# EAGLE schematic can (EAGLE 9.6.2)
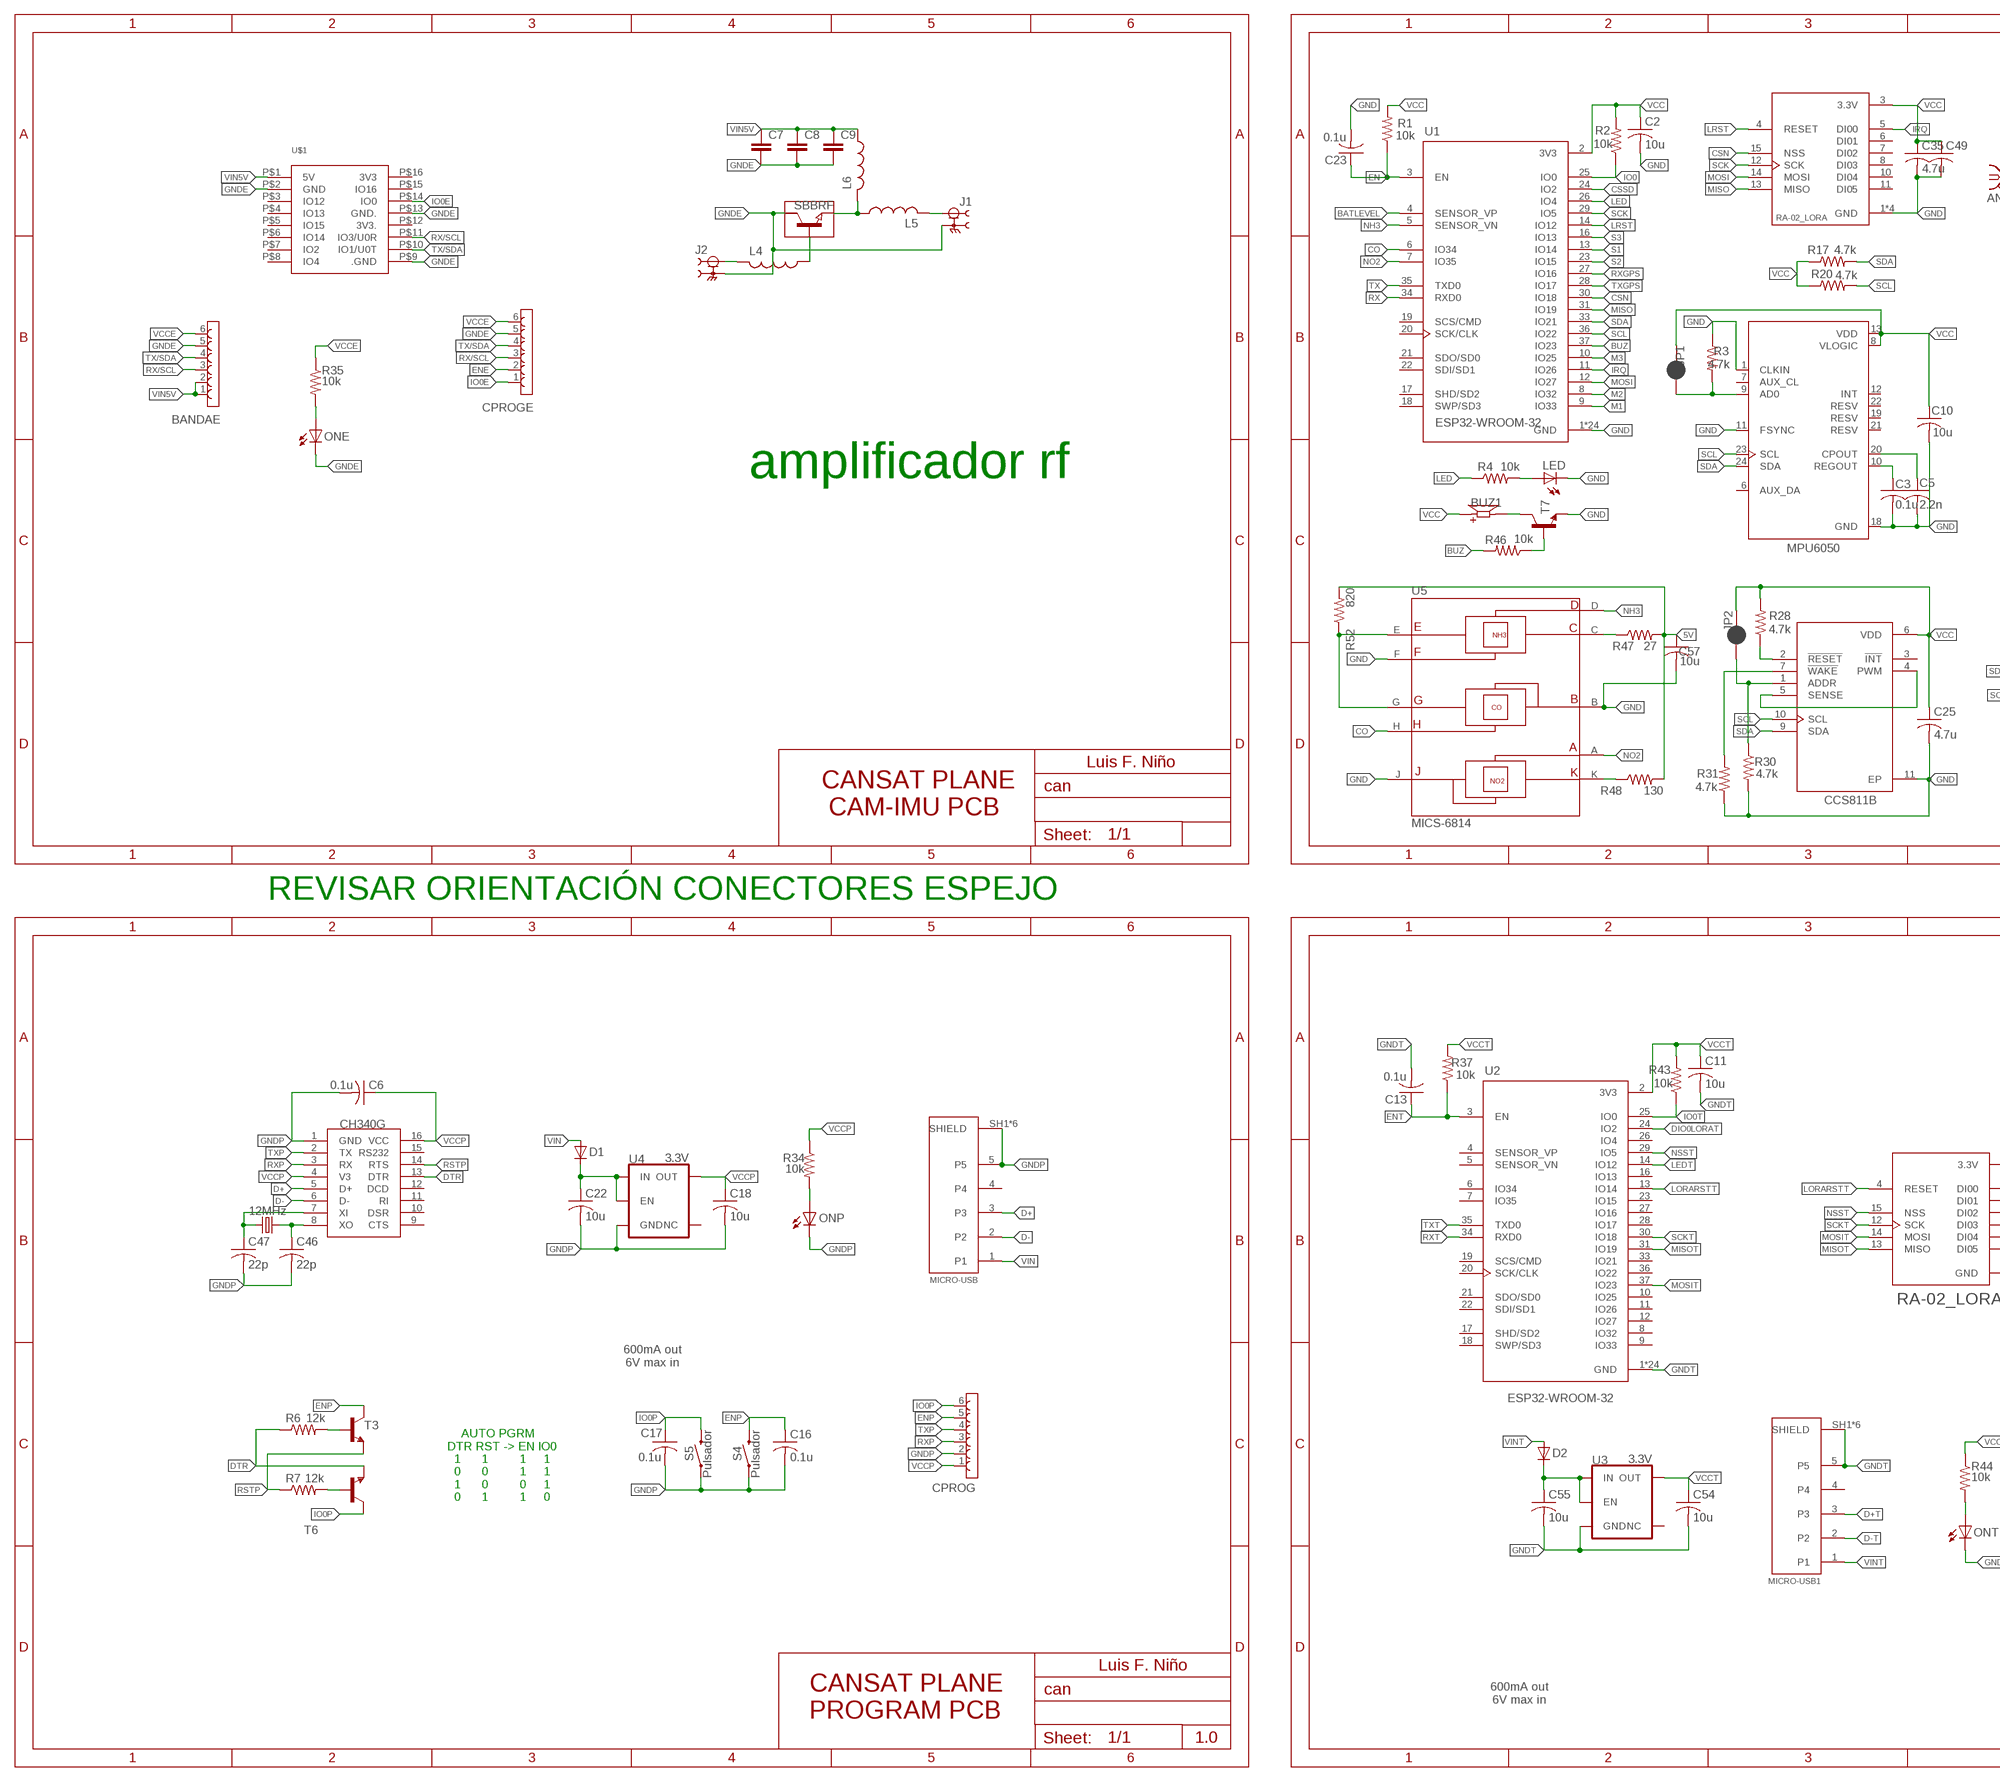
[diagram p0: schematic, sheet 1, part 1 of 2]
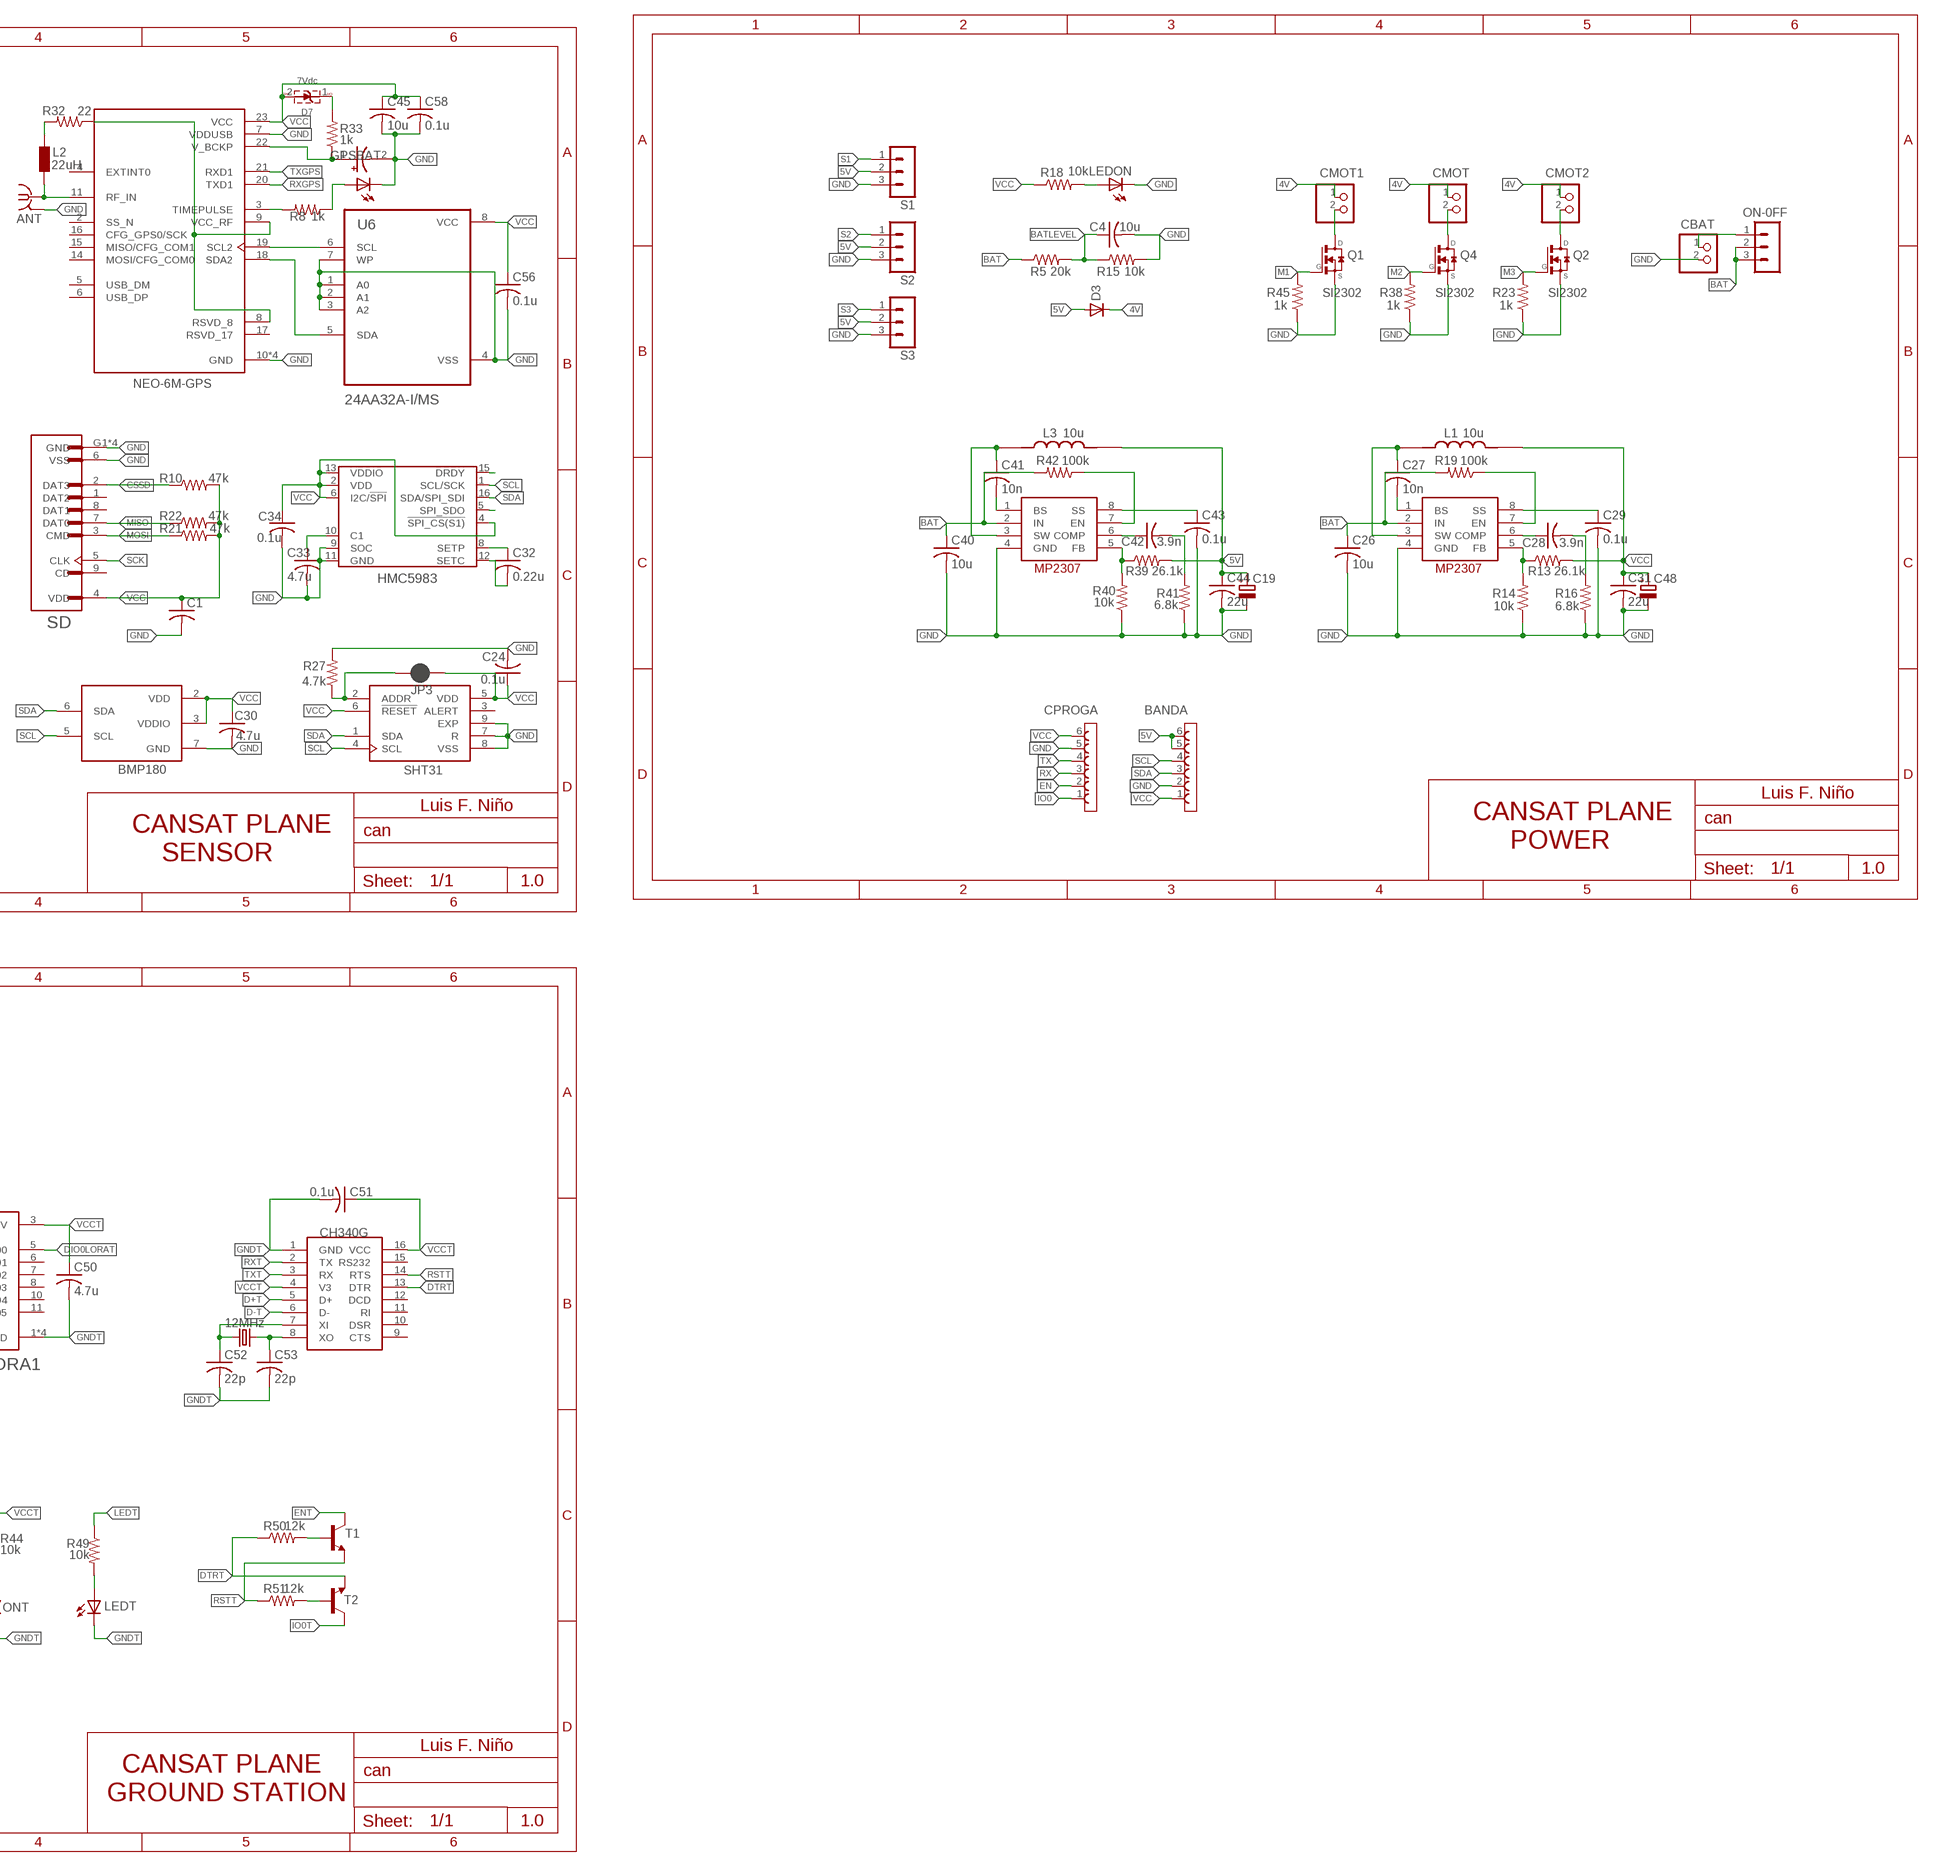
[diagram p1: schematic, sheet 1, part 2 of 2]

## Parts
BANDA  68610614122  [68610614122]
BANDAE  68610614122  [68610614122]
BMP180  BMP180  [BMP180]
BUZ1  BUZ  CMT-8530S-SMT  [CUI_CMT-8530S-SMT]
C1  C-USC0805K  [C0805K]
C2  10u  C-USC1206  [C1206]
C3  0.1u  C-USC0603K  [C0603K]
C4  10u  C-USC0603K  [C0603K]
C5  2.2n  C-USC0603K  [C0603K]
C6  0.1u  C-USC1206  [C1206]
C7  C-EUC0805K  [C0805K]
C8  C-EUC0805K  [C0805K]
C9  C-EUC0805K  [C0805K]
C10  10u  C-USC1206  [C1206]
C11  10u  C-USC1206  [C1206]
C13  0.1u  C-USC1206  [C1206]
C16  0.1u  C-USC0603K  [C0603K]
C17  0.1u  C-USC0603K  [C0603K]
C18  10u  C-USC1206  [C1206]
C19  CPOL-EU153CLV-0605  [153CLV-0605]
C22  10u  C-USC1206  [C1206]
C23  0.1u  C-USC1206  [C1206]
C24  0.1u  C-USC1206  [C1206]
C25  4.7u  C-USC1206  [C1206]
C26  10u  C-USC1206  [C1206]
C27  10n  C-USC0805  [C0805]
C28  3.9n  C-USC0805  [C0805]
C29  0.1u  C-USC0805  [C0805]
C30  4.7u  C-USC1206  [C1206]
C31  22u  C-USC1206  [C1206]
C32  0.22u  C-USC0603K  [C0603K]
C33  4.7u  C-USC0603K  [C0603K]
C34  0.1u  C-USC1206  [C1206]
C35  4.7u  C-USC1206  [C1206]
C40  10u  C-USC1206  [C1206]
C41  10n  C-USC0805  [C0805]
C42  3.9n  C-USC0805  [C0805]
C43  0.1u  C-USC0805  [C0805]
C44  22u  C-USC1206  [C1206]
C45  10u  C-USC1206  [C1206]
C46  22p  C-USC1206  [C1206]
C47  22p  C-USC1206  [C1206]
C48  CPOL-EU153CLV-0605  [153CLV-0605]
C49  C-USC0805K  [C0805K]
C50  4.7u  C-USC1206  [C1206]
C51  0.1u  C-USC1206  [C1206]
C52  22p  C-USC1206  [C1206]
C53  22p  C-USC1206  [C1206]
C54  10u  C-USC1206  [C1206]
C55  10u  C-USC1206  [C1206]
C56  0.1u  C-USC0805K  [C0805K]
C57  10u  C-USC1206  [C1206]
C58  0.1u  C-USC0805K  [C0805K]
CBAT  PINHD-1X2  [1X02]
CCS811B  CCS811B-JOPD500  [SON60P400X270X110-11N]
CH1  CH340  CH340G  [SOIC127P600X175-16N]
CH340  CH340  CH340G  [SOIC127P600X175-16N]
CMOT  PINHD-1X2  [1X02]
CMOT1  PINHD-1X2  [1X02]
CMOT2  PINHD-1X2  [1X02]
CPROG  68610614122  [68610614122]
CPROGA  68610614122  [68610614122]
CPROGE  68610614122  [68610614122]
D1  CGRM4005-G  [SOD-123_MINI-SMA]
D2  CGRM4005-G  [SOD-123_MINI-SMA]
D3  CGRM4005-G  [SOD-123_MINI-SMA]
D7  7Vdc  WE-TVS_DFN1610-2L_824045817  [WE-TVS_DFN1610-2L]
GPSBAT  XH414H  XH414H-IV01E  [CAP_XH414H-IV01E]
HMC5983  HMC5983  [HMC5983]
IC2  MP2307  [SO8-TH]
IC4  MP2307  [SO8-TH]
J1  CONSMA003.031-G  [LINX_CONSMA003.031-G]
J2  CONSMA003.031-G  [LINX_CONSMA003.031-G]
JP1  JUMPER-SMT_2_NC_PASTE_SILK  [SMT-JUMPER_2_NC_PASTE_SILK]
JP2  JUMPER-SMT_2_NC_PASTE_SILK  [SMT-JUMPER_2_NC_PASTE_SILK]
JP3  JUMPER-SMT_2_NC_PASTE_SILK  [SMT-JUMPER_2_NC_PASTE_SILK]
L1  10u  FDVE0630-H-100M=P3  [IND_FDVE0630-H-100M=P3]
L2  22uH  LL2012C  [L2012C]
L3  10u  FDVE0630-H-100M=P3  [IND_FDVE0630-H-100M=P3]
L4  L-USL2012C  [L2012C]
L5  L-USL2012C  [L2012C]
L6  L-USL3225P  [L3225P]
LED  LEDCHIPLED_0805  [CHIPLED_0805]
LED1  LEDCHIPLED_0805  [CHIPLED_0805]
LEDON  LEDCHIPLED_0805  [CHIPLED_0805]
LEDT  LEDCHIPLED_0805  [CHIPLED_0805]
MICRO-USB  1932788-1  [TE_1932788-1]
MICRO-USB1  1932788-1  [TE_1932788-1]
MPU6050  MPU-6050  [QFN50P400X400X95-24N]
NEO-6M-GPS  NEO-6M-GPS  [XCVR_NEO-6M-GPS]
ON-0FF  MA03-1  [MA03-1]
ONE  LEDCHIPLED_0805  [CHIPLED_0805]
ONP  LEDCHIPLED_0805  [CHIPLED_0805]
ONT  LEDCHIPLED_0805  [CHIPLED_0805]
Q1  SI2302  [SOT23]
Q2  SI2302  [SOT23]
Q4  SI2302  [SOT23]
R1  10k  R-US_R0603  [R0603]
R2  10k  R-US_R0603  [R0603]
R3  4.7k  R-US_R0603  [R0603]
R4  10k  R-US_R0603  [R0603]
R5  20k  R-US_R0603  [R0603]
R6  12k  R-US_R0603  [R0603]
R7  12k  R-US_R0603  [R0603]
R8  1k  R-US_R0603  [R0603]
R10  47k  R-US_R0603  [R0603]
R13  26.1k  R-US_M0805  [M0805]
R14  10k  R-US_R0603  [R0603]
R15  10k  R-US_R0603  [R0603]
R16  6.8k  R-US_R0603  [R0603]
R17  4.7k  R-US_R0603  [R0603]
R18  10k  R-US_R0603  [R0603]
R19  100k  R-US_R0603  [R0603]
R20  4.7k  R-US_R0603  [R0603]
R21  47k  R-US_R0603  [R0603]
R22  47k  R-US_R0603  [R0603]
R23  1k  R-US_R0603  [R0603]
R27  4.7k  R-US_R0603  [R0603]
R28  4.7k  R-US_R0603  [R0603]
R30  4.7k  R-US_R0603  [R0603]
R31  4.7k  R-US_R0603  [R0603]
R32  22  R-US_R0603  [R0603]
R33  1k  R-US_R0603  [R0603]
R34  10k  R-US_R0603  [R0603]
R35  10k  R-US_R0603  [R0603]
R37  10k  R-US_R0603  [R0603]
R38  1k  R-US_R0603  [R0603]
R39  26.1k  R-US_M0805  [M0805]
R40  10k  R-US_R0603  [R0603]
R41  6.8k  R-US_R0603  [R0603]
R42  100k  R-US_R0603  [R0603]
R43  10k  R-US_R0603  [R0603]
R44  10k  R-US_R0603  [R0603]
R45  1k  R-US_R0603  [R0603]
R46  10k  R-US_R0603  [R0603]
R47  27  R-US_R0603  [R0603]
R48  130  R-US_R0603  [R0603]
R49  10k  R-US_R0603  [R0603]
R50  12k  R-US_R0603  [R0603]
R51  12k  R-US_R0603  [R0603]
R52  820  R-US_R0603  [R0603]
RA-02_LORA  RA-02_LORA  [MODULE_RA-02_LORA]
RA-02_LORA1  RA-02_LORA  [MODULE_RA-02_LORA]
S1  MA03-1  [MA03-1]
S2  MA03-1  [MA03-1]
S3  MA03-1  [MA03-1]
S4  Pulsador  MOMENTARY-SWITCH-SPST-SMD-RIGHT-ANGLE  [TACTILE_SWITCH_SMD_RIGHT_ANGLE]
S5  Pulsador  MOMENTARY-SWITCH-SPST-SMD-RIGHT-ANGLE  [TACTILE_SWITCH_SMD_RIGHT_ANGLE]
SBBRF  NPN-TRANSISTIOR-2COLSOT89  [SOT89]
SD  ST-TF-003A  [SUNTECH_ST-TF-003A]
SHT31  SHT31-DIS-B  [SON50P250X250X100-9N]
T1  MMBT2222ALT1-NPN-SOT23-BEC  [SOT23-BEC]
T2  MMBT2222ALT1-NPN-SOT23-BEC  [SOT23-BEC]
T3  MMBT2222ALT1-NPN-SOT23-BEC  [SOT23-BEC]
T6  MMBT2222ALT1-NPN-SOT23-BEC  [SOT23-BEC]
T7  MMBT2222ALT1-NPN-SOT23-BEC  [SOT23-BEC]
U1  ESP32-WROOM-32  [MODULE_ESP32-WROOM-32]
U2  ESP32-WROOM-32  [MODULE_ESP32-WROOM-32]
U3  3.3V  V_REG_AP2112K-3.3V  [SOT23-5]
U4  3.3V  V_REG_AP2112K-3.3V  [SOT23-5]
U5  MICS-6814  [SENSOR_MICS-6814]
U6  24AA32A-I/MS  [SOP65P490X110-8N]
U$1  ESP32-CAM  [ESP32-CAM]
X2  ANT  MC-921  [MC-921]
Y2  12MHz  CRYSTALSMD-3.2X2.5  [CRYSTAL-SMD-3.2X2.5MM]
Y3  12MHz  CRYSTALSMD-3.2X2.5  [CRYSTAL-SMD-3.2X2.5MM]

## Nets
4V: CMOT1.1 CMOT2.1 CMOT.1 D3.C
5V: BANDA.5 BANDA.6 C19.+ C44.1 C57.1 D3.A L3.2 R39.2 R47.2 R48.2 R52.2 S1.2 S2.2 S3.2
BAT: C26.1 C40.1 IC2.2(IN) IC4.2(IN) ON-0FF.2 ON-0FF.3 R5.1 R19.2 R42.2
BATLEVEL: C4.1 R5.2 R15.1 U1.4(SENSOR_VP)
BUZ: R46.2 U1.37(IO23)
CO: U1.6(IO34) U5.H(RS2_RED)
CSN: RA-02_LORA.15(NSS) U1.30(IO18)
CSSD: R10.1 SD.2(DAT3) U1.24(IO2)
D+: CH340.5(D+) MICRO-USB.3
D+T: CH1.5(D+) MICRO-USB1.3
D-: CH340.6(D-) MICRO-USB.2
D-T: CH1.6(D-) MICRO-USB1.2
DIO0LORAT: RA-02_LORA1.5(DI00) U2.24(IO2)
DTR: CH340.13(DTR) R6.1 T6.E
DTRT: CH1.13(DTR) R50.1 T2.E
EN: C23.1 CPROGA.2 R1.1 U1.3(EN)
ENE: CPROGE.2
ENP: C16.1 CPROG.5 S4.2 T3.C
ENT: C13.1 R37.1 T1.C U2.3(EN)
GND: BANDA.2 BMP180.7(GND) C1.2 C2.2 C3.2 C4.2 C5.2 C10.2 C19.- C23.2 C24.2 C25.2 C26.2 C29.2 C30.2 C31.2 C33.2 C34.2 C35.2 C40.2 C43.2 C44.2 C45.2 C48.- C49.2 C56.2 C57.2 C58.2 CBAT.2 CCS811B.11(EP) CPROGA.5 GPSBAT.2 HMC5983.9(SOC) HMC5983.11(GND) IC2.4(GND) IC4.4(GND) LED1.C LED.C LEDON.C MPU6050.1(CLKIN) MPU6050.11(FSYNC) MPU6050.18(GND) NEO-6M-GPS.7(VDDUSB) NEO-6M-GPS.10(GND) NEO-6M-GPS.12(GND) NEO-6M-GPS.13(GND) NEO-6M-GPS.24(GND) Q1.2(S) Q2.2(S) Q4.2(S) R3.1 R14.1 R15.2 R16.1 R23.1 R27.2 R30.2 R31.1 R38.1 R40.1 R41.1 R45.1 RA-02_LORA.1(GND) RA-02_LORA.2(GND) RA-02_LORA.9(GND) RA-02_LORA.16(GND) S1.3 S2.3 S3.3 SD.6(VSS) SD.G1(GND) SD.G2(GND) SD.G3(GND) SD.G4(GND) SHT31.7(R) SHT31.8(VSS) SHT31.9(EXP) T7.E U1.1(GND) U1.15(GND) U1.38(GND) U1.39_1(GND) U1.39_2(GND) U1.39_3(GND) U1.39_4(GND) U1.39_5(GND) U1.39_6(GND) U1.39_7(GND) U1.39_8(GND) U1.39_9(GND) U1.39_10(GND) U1.39_11(GND) U1.39_12(GND) U1.39_13(GND) U1.39_14(GND) U1.39_15(GND) U1.39_16(GND) U1.39_17(GND) U1.39_18(GND) U1.39_19(GND) U1.39_20(GND) U1.39_21(GND) U5.B(RH1/RS1_RED) U5.F(RS2_NH3) U5.J(RH1/RS1_OX) U6.1(A0) U6.2(A1) U6.3(A2) U6.4(VSS) U6.7(WP) X2.2@1(GND) X2.2@2(GND)
GNDE: BANDAE.5 C7.2 C8.2 C9.2 CPROGE.5 J1.S1 J1.S2 J1.S3 J1.S4 J2.S1 J2.S2 J2.S3 J2.S4 ONE.C SBBRF.2(C) U$1.P$2(GND) U$1.P$9(.GND) U$1.P$13(GND.)
GNDP: C6.2 C16.2 C17.2 C18.2 C22.2 C46.2 C47.2 CH340.1(GND) CPROG.2 MICRO-USB.5 MICRO-USB.SH1(SHIELD) MICRO-USB.SH2(SHIELD) MICRO-USB.SH3(SHIELD) MICRO-USB.SH4(SHIELD) MICRO-USB.SH5(SHIELD) MICRO-USB.SH6(SHIELD) ONP.C S4.1 S5.1 U4.2(GND)
GNDT: C11.2 C13.2 C50.2 C51.2 C52.2 C53.2 C54.2 C55.2 CH1.1(GND) LEDT.C MICRO-USB1.5 MICRO-USB1.SH1(SHIELD) MICRO-USB1.SH2(SHIELD) MICRO-USB1.SH3(SHIELD) MICRO-USB1.SH4(SHIELD) MICRO-USB1.SH5(SHIELD) MICRO-USB1.SH6(SHIELD) ONT.C RA-02_LORA1.1(GND) RA-02_LORA1.2(GND) RA-02_LORA1.9(GND) RA-02_LORA1.16(GND) U2.1(GND) U2.15(GND) U2.38(GND) U2.39_1(GND) U2.39_2(GND) U2.39_3(GND) U2.39_4(GND) U2.39_5(GND) U2.39_6(GND) U2.39_7(GND) U2.39_8(GND) U2.39_9(GND) U2.39_10(GND) U2.39_11(GND) U2.39_12(GND) U2.39_13(GND) U2.39_14(GND) U2.39_15(GND) U2.39_16(GND) U2.39_17(GND) U2.39_18(GND) U2.39_19(GND) U2.39_20(GND) U2.39_21(GND) U3.2(GND)
IN: J2.1 L4.2
IO0: CPROGA.1 R2.1 U1.25(IO0)
IO0E: CPROGE.1 U$1.P$14(IO0)
IO0P: C17.1 CPROG.6 S5.2 T6.C
IO0T: R43.1 T2.C U2.25(IO0)
IRQ: RA-02_LORA.5(DI00) U1.11(IO26)
LED: R4.1 U1.26(IO4)
LEDT: R49.1 U2.14(IO12)
LORARSTT: RA-02_LORA1.4(RESET) U2.13(IO14)
LRST: RA-02_LORA.4(RESET) U1.14(IO12)
M1: Q1.1(G) R45.2 U1.9(IO33)
M2: Q4.1(G) R38.2 U1.8(IO32)
M3: Q2.1(G) R23.2 U1.10(IO25)
MISO: R22.1 RA-02_LORA.13(MISO) SD.7(DAT0) U1.31(IO19)
MISOT: RA-02_LORA1.13(MISO) U2.31(IO19)
MOSI: R21.1 RA-02_LORA.14(MOSI) SD.3(CMD) U1.12(IO27)
MOSIT: RA-02_LORA1.14(MOSI) U2.37(IO23)
N$1: LED.A R4.2
N$2: JP3.2 R27.1 SHT31.2(ADDR)
N$3: CCS811B.2(!RESET) R28.1
N$4: CCS811B.4(PWM) CCS811B.5(SENSE)
N$5: CCS811B.1(ADDR) JP2.2 R30.1
N$6: CCS811B.7(!WAKE) R31.2
N$7: C33.1 HMC5983.10(C1)
N$8: C32.1 HMC5983.8(SETP)
N$9: R6.2 T3.B
N$10: R7.2 T6.B
N$11: JP1.2 MPU6050.9(AD0) R3.2
N$12: C32.2 HMC5983.12(SETC)
N$13: GPSBAT.1 NEO-6M-GPS.22(V_BCKP) R33.1
N$14: L2.1 R32.2
N$15: CMOT.2 Q4.3(D)
N$16: C22.1 D1.C U4.1(IN) U4.3(EN)
N$17: D7.1(I/O) R33.2
N$18: IC4.5(FB) R39.1 R40.2
N$19: ONP.A R34.2
N$20: NEO-6M-GPS.8(RSVD_8) NEO-6M-GPS.9(VCC_RF) R32.1
N$21: L2.2 NEO-6M-GPS.11(RF_IN) X2.1
N$22: CMOT1.2 Q1.3(D)
N$23: BUZ1.N T7.C
N$24: ONE.A R35.2
N$25: C42.1 IC4.6(COMP)
N$26: IC4.7(EN) R42.1
N$27: HMC5983.5(SPI_SDO)
N$28: HMC5983.15(DRDY)
N$29: C41.2 IC4.1(BS)
N$30: R46.1 T7.B
N$31: C3.1 MPU6050.10(REGOUT)
N$32: C5.1 MPU6050.20(CPOUT)
N$33: C41.1 IC4.3(SW) L3.1
N$37: C42.2 R41.2
N$38: C43.1 IC4.8(SS)
N$39: CMOT2.2 Q2.3(D)
N$40: NEO-6M-GPS.19(SCL2) U6.6(SCL)
N$41: ONT.A R44.2
N$42: NEO-6M-GPS.18(SDA2) U6.5(SDA)
N$46: R52.1 U5.E(RH2_NH3) U5.G(RH2_RED)
N$49: IC2.5(FB) R13.1 R14.2
N$53: C46.1 CH340.8(XO) Y2.1
N$54: C47.1 CH340.7(XI) Y2.3
N$55: LED1.A R8.1
N$56: C53.1 CH1.8(XO) Y3.1
N$57: C52.1 CH1.7(XI) Y3.3
N$58: C55.1 D2.C U3.1(IN) U3.3(EN)
N$59: C28.1 IC2.6(COMP)
N$60: C28.2 R16.2
N$61: LEDT.A R49.2
N$62: IC2.7(EN) R19.1
N$63: C27.2 IC2.1(BS)
N$64: CBAT.1 ON-0FF.1
N$65: C27.1 IC2.3(SW) L1.1
N$66: C29.1 IC2.8(SS)
N$67: LEDON.A R18.2
N$68: R50.2 T1.B
N$69: R51.2 T2.B
N$70: R47.1 U5.C(RH1_NH3)
N$71: R48.1 U5.K(RH2_OX)
N$72: NEO-6M-GPS.3(TIMEPULSE) R8.2
N$73: L4.1 SBBRF.1(B)
N$74: L5.1 L6.2 SBBRF.3(E)
N$76: J1.1 L5.2
NH3: U1.5(SENSOR_VN) U5.D(RS1_NH3)
NO2: U1.7(IO35) U5.A(RS2)
NSST: RA-02_LORA1.15(NSS) U2.29(IO5)
RSTP: CH340.14(RTS) R7.1 T3.E
RSTT: CH1.14(RTS) R51.1 T1.E
RX: CPROGA.3 U1.34(RXD0)
RX/SCL: BANDAE.3 CPROGE.3 U$1.P$11(IO3/U0R)
RXGPS: NEO-6M-GPS.20(TXD1) U1.27(IO16)
RXP: CH340.3(RX) CPROG.3
RXT: CH1.2(TX) U2.34(RXD0)
S1: S1.1 U1.13(IO14)
S2: S2.1 U1.23(IO15)
S3: S3.1 U1.16(IO13)
SCK: RA-02_LORA.12(SCK) SD.5(CLK) U1.29(IO5)
SCKT: RA-02_LORA1.12(SCK) U2.30(IO18)
SCL: BANDA.4 BMP180.5(SCL) CCS811B.10(SCL) HMC5983.1(SCL/SCK) MPU6050.23(SCL) R20.2 SHT31.4(SCL) U1.36(IO22)
SDA: BANDA.3 BMP180.6(SDA) CCS811B.9(SDA) HMC5983.16(SDA/SPI_SDI) MPU6050.24(SDA) R17.2 SHT31.1(SDA) U1.33(IO21)
TX: CPROGA.4 U1.35(TXD0)
TX/SDA: BANDAE.4 CPROGE.4 U$1.P$10(IO1/U0T)
TXGPS: NEO-6M-GPS.21(RXD1) U1.28(IO17)
TXP: CH340.2(TX) CPROG.4
TXT: CH1.3(RX) U2.35(TXD0)
VCC: BANDA.1 BMP180.2(VDD) BMP180.3(VDDIO) BUZ1.P C1.1 C2.1 C10.1 C24.1 C25.1 C30.1 C31.1 C34.1 C35.1 C45.1 C48.+ C49.1 C56.1 C58.1 CCS811B.6(VDD) CPROGA.6 D7.2(GND) HMC5983.2(VDD) HMC5983.4(!SPI_CS(S1)) HMC5983.6(I2C/!SPI) HMC5983.13(VDDIO) JP1.1 JP2.1 JP3.1 L1.2 MPU6050.8(VLOGIC) MPU6050.13(VDD) NEO-6M-GPS.23(VCC) R1.2 R2.2 R10.2 R13.2 R17.1 R18.1 R20.1 R21.2 R22.2 R28.2 RA-02_LORA.3(3.3V) SD.4(VDD) SHT31.5(VDD) SHT31.6(!RESET) U1.2(3V3) U6.8(VCC)
VCCE: BANDAE.6 CPROGE.6 R35.1
VCCP: C6.1 C18.1 CH340.4(V3) CH340.16(VCC) CPROG.1 R34.1 U4.5(OUT)
VCCT: C11.1 C50.1 C51.1 C54.1 CH1.4(V3) CH1.16(VCC) R37.2 R43.2 R44.1 RA-02_LORA1.3(3.3V) U2.2(3V3) U3.5(OUT)
VIN: D1.A MICRO-USB.1
VIN5V: BANDAE.1 BANDAE.2 C7.1 C8.1 C9.1 L6.1 U$1.P$1(5V)
VINT: D2.A MICRO-USB1.1
Unconnected: CCS811B.3(!INT) CH1.9(CTS) CH1.10(DSR) CH1.11(RI) CH1.12(DCD) CH1.15(RS232) CH340.9(CTS) CH340.10(DSR) CH340.11(RI) CH340.12(DCD) CH340.15(RS232) MICRO-USB1.4 MICRO-USB.4 MPU6050.6(AUX_DA) MPU6050.7(AUX_CL) MPU6050.12(INT) MPU6050.19(RESV) MPU6050.21(RESV) MPU6050.22(RESV) NEO-6M-GPS.2(SS_N) NEO-6M-GPS.4(EXTINT0) NEO-6M-GPS.5(USB_DM) NEO-6M-GPS.6(USB_DP) NEO-6M-GPS.14(MOSI/CFG_COM0) NEO-6M-GPS.15(MISO/CFG_COM1) NEO-6M-GPS.16(CFG_GPS0/SCK) NEO-6M-GPS.17(RSVD_17) RA-02_LORA1.6(DI01) RA-02_LORA1.7(DI02) RA-02_LORA1.8(DI03) RA-02_LORA1.10(DI04) RA-02_LORA1.11(DI05) RA-02_LORA.6(DI01) RA-02_LORA.7(DI02) RA-02_LORA.8(DI03) RA-02_LORA.10(DI04) RA-02_LORA.11(DI05) SBBRF.2@1(C/) SD.1(DAT2) SD.8(DAT1) SD.9(CD) SHT31.3(ALERT) U1.17(SHD/SD2) U1.18(SWP/SD3) U1.19(SCS/CMD) U1.20(SCK/CLK) U1.21(SDO/SD0) U1.22(SDI/SD1) U2.4(SENSOR_VP) U2.5(SENSOR_VN) U2.6(IO34) U2.7(IO35) U2.8(IO32) U2.9(IO33) U2.10(IO25) U2.11(IO26) U2.12(IO27) U2.16(IO13) U2.17(SHD/SD2) U2.18(SWP/SD3) U2.19(SCS/CMD) U2.20(SCK/CLK) U2.21(SDO/SD0) U2.22(SDI/SD1) U2.23(IO15) U2.26(IO4) U2.27(IO16) U2.28(IO17) U2.33(IO21) U2.36(IO22) U3.4(NC) U4.4(NC) U$1.P$3(IO12) U$1.P$4(IO13) U$1.P$5(IO15) U$1.P$6(IO14) U$1.P$7(IO2) U$1.P$8(IO4) U$1.P$12(3V3.) U$1.P$15(IO16) U$1.P$16(3V3)

## Notes on the sheet
- amplificador rf
- Luis F. Niño
- Luis F. Niño | Luis F. Niño
- CANSAT PLANE
       POWER
- CANSAT PLANE
   CAM-IMU PCB
- CANSAT PLANE
      SENSOR
- 1.0
- 1.0
- REVISAR ORIENTACIÓN CONECTORES ESPEJO
- 600mA out
  6V max in
- AUTO PGRM
  DTR RST -> EN IO0
    1      1         1     1
    0      0         1     1
    1      0         0     1
    0      1         1     0
- Luis F. Niño | Luis F. Niño
- 600mA out
  6V max in
- CANSAT PLANE
  PROGRAM PCB
- CANSAT PLANE
  GROUND STATION
- 1.0 | 1.0

## Library data of the parts
BANDA BANDAE CPROG CPROGA CPROGE = 68610614122:68610614122: WR-FPC 1.00mm SMT ZIF Horizontal Top Contact, 6 Pins=>Code : Con_FPC_ZIF_1.00_68610614122 <http://katalog.we-online.de/media/images/eican/Con_FPC_ZIF_1.00_6861xx14122_pf2.jpg> Details see: http://katalog.we-online.de/en/em/686_1xx_141_22 Created 2014-07-09, Karrer Zheng 2014 (C) Würth Elektronik Check prices <https://pricing.snapeda.com/parts/68610614122/Wurth%20Electronics/view-part?ref=eda>; AVAILABILITY: In Stock; DESCRIPTION: Receptacles (standard) ZIF FPC Total number of pins 6 Wuerth Elektronik 68610614122 Contact spacing: 1 mm 1 pc(s); MF: Wurth Electronics; MP: 68610614122; PACKAGE: None; PRICE: None; PURCHASE-URL: https://pricing.snapeda.com/search/part/68610614122/?ref=eda
BMP180 = BMP180:BMP180: BOSCH BMP180 DIGITAL BAROMETRIC PRESSURE SENSOR Web page: http://www.bosch-sensortec.com/en/homepage/products_3/environmental_sensors_1/bmp180_1/bmp180 Datasheet: http://ae-bst.resource.bosch.com/media/products/dokumente/bmp180/BST-BMP180-DS000-09.pdf The BMP180 is the function compatible successor of the BMP085, a new generation of high precision digital pressure sensors for consumer applications. The ultra-low power, low voltage electronics of the BMP180 is optimized for use in mobile phones, PDAs, GPS navigation devices and outdoor equipment. With a low altitude noise of merely 0.25m at fast conversion time, the BMP180 offers superior performance. The I2C interface allows for easy system integration with a microcontroller. The BMP180 is based on piezo-resistive technology for EMC robustness, high accuracy and linearity as well as long term stability. Key features: - Temperature measurement included - I2C interface - Fully calibrated - Pb-free, halogen-free and RoHS compliant, - MSL 1 Basic specs: Pressure range: 300 to 1100hPa (+9000m to -500m relating to sea level) Supply voltage: 1.8 to 3.6V (VDD), 1.62V to 3.6V (VDDIO) Package: LGA package with metal lid Small footprint: 3.6mm x 3.8mm Super-flat: 0.93mm height Low power: 5μA at 1 sample / sec. in standard mode Low noise: 0.06hPa (0.5m) in ultra low power mode, 0.02hPa (0.17m) advanced resolution mode Typical applications: - Enhancement of GPS navigation (dead-reckoning, slope detection, etc.) - In- and out-door navigation - Leisure and sports - Weather forecast - Vertical velocity indication (rise/sink speed) Check prices <https://pricing.snapeda.com/parts/BMP180/Bosch%20Sensortec/view-part?ref=eda>; AVAILABILITY: In Stock; DESCRIPTION: Pressure Sensor 4.35PSI ~ 15.95PSI (30kPa ~ 110kPa) Absolute 16 ~ 19 b 7-VLGA; MF: Bosch Sensortec; MP: BMP180; PACKAGE: VLGA-7 Bosch Sensortec; PRICE: None
BUZ1 = CMT-8530S-SMT:CMT-8530S-SMT: 8.5 mm, 3.6 Vo-p, 90 dB, Surface Mount (SMT), Magnetic Audio Transducer Buzzer Check prices <https://pricing.snapeda.com/search/part/CMT-8530S-SMT-TR/?ref=eda>; AVAILABILITY: Good; CUI_PURCHASE_URL: https://www.cuidevices.com/product/audio/buzzers/audio-transducers/cmt-8530s-smt-tr?utm_source=snapeda.com&utm_medium=referral&utm_campaign=snapedaBOM; DESCRIPTION: 8.5 mm, 3.6 Vo-p, 90 dB, Surface Mount (SMT), Magnetic Audio Transducer Buzzer; MF: CUI Devices; MP: CMT-8530S-SMT-TR; PACKAGE: CUI; PRICE: None; PURCHASE-URL: https://pricing.snapeda.com/search/part/CMT-8530S-SMT-TR/?ref=eda
C1-C6 C10 C11 C13 C18 C22-C35 C40-C47 C49-C58 = rcl:C-US: CAPACITOR, American symbol; SPICEPREFIX: C
C7-C9 = rcl:C-EU: CAPACITOR, European symbol; SPICEPREFIX: C
C16 C17 = resistor:C-US: CAPACITOR, American symbol
C19 C48 = rcl:CPOL-EU: POLARIZED CAPACITOR, European symbol; SPICEPREFIX: C
CBAT CMOT CMOT1 CMOT2 = pinhead:PINHD-1X2: PIN HEADER
CCS811B = CCS811B-JOPD500:CCS811B-JOPD500: Low Power Digital Sensor For Ind Check prices <https://pricing.snapeda.com/parts/CCS811B-JOPD500/ScioSense/view-part?ref=eda>; AVAILABILITY: Not in stock; DESCRIPTION: LOW POWER DIGITAL SENSOR FOR IND; MF: ScioSense; MP: CCS811B-JOPD500; PACKAGE: None; PRICE: None
CH1 CH340 = CH340G:CH340G: Check prices <https://pricing.snapeda.com/parts/Ch340G/WCH/view-part?ref=eda>; AVAILABILITY: Not in stock; DESCRIPTION: USB Interface Integrated Circuit; MF: WCH; MP: Ch340G; PACKAGE: Package; PRICE: None
D1-D3 = diode:CGRM400*-G: Molded plasitc,JEDEC SOD-123/Mini SMA Source: Comchip CGRM4001-G.pdf
D7 = Wurth_EMC Components_WE-TVS:WE-TVS_DFN1610-2L_824045817: WE-TVS TVS Diode – Standard Series Characteristics Fast turn-on Low clamping voltage High ESD withstand voltage Uni- or bidirectional protection Small package Epoxy flame resistant UL94 V-0 Applications DC power supply USB Power Delivery (PD) Headsets and accessories PDAs Digital cameras MP3-Player Touch Panels Notebooks ESD, EFT and Surge Protection ESD protection in accordance with EN 61000-4-2 – 8 kV contact discharge – 15 kV air discharge <https://www.we-online.com/catalog/media/o106433v209%20Family_WE-TVS_Standard.jpg> Details see: https://www.we-online.com/catalog/en/WE-TVS Updated by Ella Wu 2019-07-12 2019 (C) Wurth Elektronik; C-CH: 830pF; CHANNELS: 1; DATASHEET-URL: https://www.we-online.com/catalog/datasheet/824045817.pdf; IPEAK: 60A; MOUNT: SMT; PART-NUMBER: 824045817; VBR: 7.8V
GPSBAT = XH414H-IV01E:XH414H-IV01E: Cap 80000uF 3.3V (4.8 X 4.8 X 1.85mm) Stacked Coin 60°C Check prices <https://pricing.snapeda.com/parts/XH414H-IV01E/Seiko%20Instruments/view-part?ref=eda>; AVAILABILITY: Not in stock; DESCRIPTION: 70mF (EDLC) Supercapacitor 3.3V Coin, Wide and Corner Terminals; MF: Seiko Instruments; MP: XH414H-IV01E; PACKAGE: Coin Wide and Corner Terminals Seiko; PRICE: None
HMC5983 = HMC5983:HMC5983: Check prices <https://pricing.snapeda.com/parts/HMC5983-T/Honeywell%20Aerospace/view-part?ref=eda>; AVAILABILITY: Not in stock; DESCRIPTION: Magnetoresistive Sensor X, Y, Z Axis 16-LPCC (3x3); MF: Honeywell Aerospace; MP: HMC5983-T; PACKAGE: LCC-16 Honeywell; PRICE: None
IC2 IC4 = MP2307:MP2307: Monolithic synchronous buck regulator https://cdn-shop.adafruit.com/datasheets/MP2307_r1.9.pdf; AVAILABILITY: Unavailable; DESCRIPTION: Buck Switching Regulator IC Positive Adjustable 0.925V 1 Output 3A 8-SOIC (0.154, 3.90mm Width) Exposed Pad; MF: Monolithic Power; MP: MP2307; PACKAGE: SOIC-8 Monolithic Power; PRICE: None
J1 J2 = CONSMA003.031-G:CONSMA003.031-G: Check availability <https://pricing.snapeda.com/parts/CONSMA003.031-G/Linx%20Technologies/view-part?ref=eda>; AVAILABILITY: In Stock; DESCRIPTION: SMA Connector Straight Jack (Female), PCB Edge Mount, 0.031 Thick PCB, Gold; MF: Linx Technologies; MP: CONSMA003.031-G; PACKAGE: None; PRICE: None; PURCHASE-URL: https://pricing.snapeda.com/search/part/CONSMA003.031-G/?ref=eda
JP1-JP3 = SparkFun-Jumpers:JUMPER-SMT_2_NC_PASTE: Normally closed solder jumper This jumper has an aperture in the stencil to allow solder paste to bridge the split in the wire so it's normally closed (NC). Wick off the solder to open the connection. Reapply solder to reclose the connection.
L1 L3 = FDVE0630-H-100M_P3:FDVE0630-H-100M=P3: Metal alloy Power Inductor Check prices <https://pricing.snapeda.com/parts/FDVE0630-H-100M%3DP3/Murata/view-part?ref=eda>; AVAILABILITY: In Stock; DESCRIPTION: Inductor with Inductance: 10uH Tol. +/-20%, Package: 2926 (7467); MF: Murata; MP: FDVE0630-H-100M=P3; PACKAGE: NONSTANDARD; PRICE: None
L2 = eagle-ltspice:L: INDUCTOR, European symbol; SPICEMODEL: NONE; SPICEPREFIX: L
L4-L6 = resistor:L-US: INDUCTOR, American symbol
LED LED1 LEDON LEDT ONE ONP ONT = led:LED: LED OSRAM: - CHIPLED LG R971, LG N971, LY N971, LG Q971, LY Q971, LO R971, LY R971 LH N974, LH R974 LS Q976, LO Q976, LY Q976 LO Q996 - Hyper CHIPLED LW Q18S LB Q993, LB Q99A, LB R99A - SideLED LS A670, LO A670, LY A670, LG A670, LP A670 LB A673, LV A673, LT A673, LW A673 LH A674 LY A675 LS A676, LA A676, LO A676, LY A676, LW A676 LS A679, LY A679, LG A679 - Hyper Micro SIDELED® LS Y876, LA Y876, LO Y876, LY Y876 LT Y87S - SmartLED LW L88C, LW L88S LB L89C, LB L89S, LG L890 LS L89K, LO L89K, LY L89K LS L896, LA L896, LO L896, LY L896 - TOPLED LS T670, LO T670, LY T670, LG T670, LP T670 LSG T670, LSP T670, LSY T670, LOP T670, LYG T670 LG T671, LOG T671, LSG T671 LB T673, LV T673, LT T673, LW T673 LH T674 LS T676, LA T676, LO T676, LY T676, LB T676, LH T676, LSB T676, LW T676 LB T67C, LV T67C, LT T67C, LS T67K, LO T67K, LY T67K, LW E67C LS E67B, LA E67B, LO E67B, LY E67B, LB E67C, LV E67C, LT E67C LW T67C LS T679, LY T679, LG T679 LS T770, LO T770, LY T770, LG T770, LP T770 LB T773, LV T773, LT T773, LW T773 LH T774 LS E675, LA E675, LY E675, LS T675 LS T776, LA T776, LO T776, LY T776, LB T776 LHGB T686 LT T68C, LB T68C - Hyper Mini TOPLED® LB M676 - Mini TOPLED Santana® LG M470 LS M47K, LO M47K, LY M47K Source: http://www.osram.convergy.de LUXEON: - LUMILED® LXK2-PW12-R00, LXK2-PW12-S00, LXK2-PW14-U00, LXK2-PW14-V00 LXK2-PM12-R00, LXK2-PM12-S00, LXK2-PM14-U00 LXK2-PE12-Q00, LXK2-PE12-R00, LXK2-PE12-S00, LXK2-PE14-T00, LXK2-PE14-U00 LXK2-PB12-K00, LXK2-PB12-L00, LXK2-PB12-M00, LXK2-PB14-N00, LXK2-PB14-P00, LXK2-PB14-Q00 LXK2-PR12-L00, LXK2-PR12-M00, LXK2-PR14-Q00, LXK2-PR14-R00 LXK2-PD12-Q00, LXK2-PD12-R00, LXK2-PD12-S00 LXK2-PH12-R00, LXK2-PH12-S00 LXK2-PL12-P00, LXK2-PL12-Q00, LXK2-PL12-R00 Source: www.luxeon.com KINGBRIGHT: KA-3528ASYC Source: www.kingbright.com
MICRO-USB MICRO-USB1 = MICROUSB:1932788-1: UUSB 2-DIP REVERSE MOUNT; AVAILABILITY: Unavailable; CENTERLINE_PITCH: .65 mm[.025 in]; COMMENT: 1932788-1; DESCRIPTION: Conn Micro USB RCP 5 POS 0.65mm Solder RA SMD 5 Terminal 1 Port T/R; MF: TE Connectivity; MP: 1932788-1; NUMBER_OF_POSITIONS: 5; PACKAGE: DIP-2 TE Connectivity; PRICE: None; PRODUCT_TYPE: Connector; TE_PURCHASE_URL: https://www.te.com/usa-en/product-1932788-1.html?te_bu=Cor&te_type=disp&te_campaign=seda_glo_cor-seda-global-disp-prtnr-fy19-seda-model-bom-cta_sma-317_1&elqCampaignId=32493
MPU6050 = MPU-6050:MPU-6050: MPU-6050 Six-Axis (Gyro + Accelerometer) MEMS MotionTracking™ Devices Check prices <https://pricing.snapeda.com/parts/MPU-6050/TDK%20InvenSense/view-part?ref=eda>; AVAILABILITY: In Stock; DESCRIPTION: Accelerometer, Gyroscope, 6 Axis Sensor I²C Output; MF: TDK InvenSense; MP: MPU-6050; PACKAGE: VFQFN-24 TDK InvenSense; PRICE: None; PURCHASE-URL: https://pricing.snapeda.com/search/part/MPU-6050/?ref=eda
NEO-6M-GPS = NEO-6M-GPS:NEO-6M-GPS: SMD GPS Module Check prices <https://pricing.snapeda.com/parts/NEO-6M-GPS/u-blox/view-part?ref=eda>; AVAILABILITY: Not in stock; DESCRIPTION: SMD GPS Module;; MF: u-blox; MP: NEO-6M-GPS; PACKAGE: None; PRICE: None
ON-0FF S1-S3 = con-lstb:MA03-1: PIN HEADER; OC_FARNELL: unknown; OC_NEWARK: unknown
Q1 Q2 Q4 = SI2302:SI2302: MOSFET N-Channel 20 V (D-S) Check prices <https://pricing.snapeda.com/parts/SI2302/Vishay%20Siliconix/view-part?ref=eda>; AVAILABILITY: In Stock; DESCRIPTION: N-Channel 20V 2.6A (Ta) 710mW (Ta) Surface Mount SOT-23-3 (TO-236); MF: Vishay Siliconix; MP: SI2302; PACKAGE: SOT-23-3 Vishay Siliconix; PRICE: None; PURCHASE-URL: https://pricing.snapeda.com/search/part/SI2302/?ref=eda
R1 R2 R4-R8 R10 R14-R23 R27 R28 R30-R35 R37 R38 R40-R52 = resistor:R-US_: RESISTOR, American symbol
R3 R13 R39 = rcl:R-US_: RESISTOR, American symbol; SPICEPREFIX: R
RA-02_LORA RA-02_LORA1 = RA-02_LORA:RA-02_LORA: Ra-02 LoRa RF M5Stack Platform Evaluation Expansion Board Check prices <https://pricing.snapeda.com/parts/Ra-02%20LoRa/AI-Thinker/view-part?ref=eda>; AVAILABILITY: Not in stock; DESCRIPTION: Ra-02 LoRa RF M5Stack Platform Evaluation Expansion Board; MF: AI-Thinker; MP: Ra-02 LoRa; PACKAGE: Package; PRICE: None
S4 S5 = SparkFun-Switches:MOMENTARY-SWITCH-SPST: Momentary Switch (Pushbutton) - SPST Normally-open (NO) SPST momentary switches (buttons, pushbuttons). Variants PTH-12MM - 12mm square, through-hole Momentary Pushbutton Switch - 12mm Square <https://www.sparkfun.com/products/9190> (COM-09190) PTH-6.0MM, PTH-6.0MM-KIT - 6.0mm square, through-hole Mini Pushbutton Switch <https://www.sparkfun.com/products/97> (COM-00097) KIT package intended for soldering kit's - only one side of pads' copper is exposed. PTH-RIGHT-ANGLE-KIT - Right-angle, through-hole Right Angle Tactile Button <https://www.sparkfun.com/products/10791> - Used on SparkFun BigTime Watch Kit <https://www.sparkfun.com/products/11734> SMD-12MM - 12mm square, surface-mount Tactile Button - SMD (12mm) <https://www.sparkfun.com/products/12993> (COM-12993) Used on SparkFun PicoBoard <https://www.sparkfun.com/products/11888> SMD-4.5MM - 4.5mm Square Trackball Switch Used on SparkFun Blackberry Trackballer Breakout <https://www.sparkfun.com/products/13169> SMD-4.6MMX2.8MM - 4.60mm x 2.80mm, surface mount Used on SparkFun SAMD21 Mini Breakout <https://www.sparkfun.com/products/13664> SMD-5.2MM, SMD-5.2-REDUNDANT - 5.2mm square, surface-mount Mini Pushbutton Switch - SMD <https://www.sparkfun.com/products/8720> (COM-08720) Used on Arduino Pro Mini <https://www.sparkfun.com/products/11114> REDUNDANT package connects both switch circuits together SMD-6.0X3.5MM - 6.0 x 3.5mm, surface mount Momentary Reset Switch SMD <https://www.sparkfun.com/products/8229> (COM-08229) SMD-6.2MM-TALL - 6.2mm square, surface mount Tactile Button - SMD (6mm) <https://www.sparkfun.com/products/12992> Used on SparkFun Digital Sandbox <https://www.sparkfun.com/products/12651> SMD-RIGHT-ANGLE - Right-angle, surface mount Used on SparkFun Block for Intel® Edison - Arduino <https://www.sparkfun.com/products/13036>; PROD_ID: COMP-12265
SBBRF = semicon-smd-ipc:NPN-TRANSISTIOR-2COL: NPN TRANSISTOR 2 colletor pins
SD = ST-TF-003A:ST-TF-003A: Micro SD Card Socket Check prices <https://pricing.snapeda.com/parts/ST-TF-003A/Suntech/view-part?ref=eda>; AVAILABILITY: Not in stock; DESCRIPTION: Micro SD Card Socket; MF: Suntech; MP: ST-TF-003A; PACKAGE: None; PRICE: None
SHT31 = SHT31-DIS-B:SHT31-DIS-B: SHT31 Series 5.5 V 800 µA Surface Mount Humidity and Temperature Sensor Check prices <https://pricing.snapeda.com/parts/SHT31-DIS-B/Sensirion%20AG/view-part?ref=eda>; AVAILABILITY: In Stock; DESCRIPTION: Humidity Temperature Sensor 0 ~ 100% RH I²C ±2% RH 8s Surface Mount; MF: Sensirion AG; MP: SHT31-DIS-B; PACKAGE: TDFN-8 Sensirion; PRICE: None; PURCHASE-URL: https://pricing.snapeda.com/search/part/SHT31-DIS-B/?ref=eda
T1-T3 T6 = transistor:*-NPN-: NPN Transistror BF959 corrected 2008.03.06
T7 = transistor-neu-to92:*-NPN-: NPN Transistror BF959 corrected 2008.03.06
U1 = ESP32-WROOM-32:ESP32-WROOM-32: Bluetooth, WiFi Transceiver Module 2.4GHz ~ 2.5GHz Surface Mount Check prices <https://pricing.snapeda.com/parts/ESP32-WROOM-32/Espressif%20Systems/view-part?ref=eda>; AVAILABILITY: No availability data; DESCRIPTION: Bluetooth, WiFi 802.11b/g/n, Bluetooth v4.2 +EDR, Class 1, 2 and 3 Transceiver Module 2.4GHz ~ 2.5GHz Antenna Not Included, U.FL Surface Mount; MF: Espressif Systems; MP: ESP32-WROOM-32; PACKAGE: Module Espressif Systems; PRICE: None; SPICEPREFIX: X
U2 = ESP32-WROOM-32:ESP32-WROOM-32: Bluetooth, WiFi Transceiver Module 2.4GHz ~ 2.5GHz Surface Mount Check prices <https://pricing.snapeda.com/parts/ESP32-WROOM-32/Espressif%20Systems/view-part?ref=eda>; AVAILABILITY: No availability data; DESCRIPTION: Bluetooth, WiFi 802.11b/g/n, Bluetooth v4.2 +EDR, Class 1, 2 and 3 Transceiver Module 2.4GHz ~ 2.5GHz Antenna Not Included, U.FL Surface Mount; MF: Espressif Systems; MP: ESP32-WROOM-32; PACKAGE: Module Espressif Systems; PRICE: None
U3 U4 = SparkFun-IC-Power:V_REG_AP2112: AP2112 - 600mA CMOS LDO Regulator w/ Enable The AP2112 is CMOS process low dropout linear regulator with enable function, the regulator delivers a guaranteed 600mA (min.) continuous load current. Features Output Voltage Accuracy: ±1.5% Output Current: 600mA (Min.) Foldback Short Current Protection: 50mA Enable Function to Turn ON/OFF VOUT Low Dropout Voltage (3.3V): 250mV (Typ.) @IOUT=600mA Excellent Load Regulation: 0.2%/A (Typ.) Excellent Line Regulation: 0.02%/V (Typ.) Low Quiescent Current: 55μA (Typ.) Low Standby Current: 0.01μA (Typ.) Low Output Noise: 50μVRMS PSRR: 100Hz -65dB, 1kHz -65dB OTSD Protection Stable with 1.0μF Flexible Cap: Ceramic, Tantalum and Aluminum Electrolytic Operation Temperature Range: -40°C to 85°C ESD: MM 400V, HBM 4000V; PROD_ID: VREG-12457
U5 = MICS-6814:MICS-6814: Three gas SMD NH3, CO and NO2 Check availability <https://pricing.snapeda.com/parts/MICS-6814/Amphenol%20SGX%20Sensortech/view-part?ref=eda>; AVAILABILITY: In Stock; DESCRIPTION: Ammonia (NH3), Carbon Monoxide (CO) Sensor -; MF: Amphenol SGX Sensortech; MP: MICS-6814; PACKAGE: None; PRICE: None; PURCHASE-URL: https://pricing.snapeda.com/search/part/MICS-6814/?ref=eda
U6 = 24AA32A-I_MS:24AA32A-I/MS: Check availability <https://pricing.snapeda.com/parts/24AA32A-I/MS/Microchip/view-part?ref=eda>; AVAILABILITY: In Stock; DESCRIPTION: EEPROM Memory IC 32Kb (4K x 8) I²C 400 kHz 900 ns 8-MSOP; MF: Microchip; MP: 24AA32A-I/MS; PACKAGE: MSOP-8 Microchip; PRICE: None; PURCHASE-URL: https://pricing.snapeda.com/search/part/24AA32A-I/MS/?ref=eda
U$1 = ESP32-CAM:ESP32-CAM: Check availability <https://pricing.snapeda.com/parts/ESP32-CAM/AI-Thinker/view-part?ref=eda>; AVAILABILITY: Not in stock; DESCRIPTION: ESP32 ESP32 Transceiver; 802.11 a/b/g/n (Wi-Fi, WiFi, WLAN), Bluetooth® Smart 4.x Low Energy (BLE) Evaluation Board; MF: AI-Thinker; MP: ESP32-CAM; PACKAGE: None; PRICE: None
X2 = con-coax:MC-921: COAX. MICROWAVE CONNECTOR O/D diam 2.1 Source: www.tycoelectronics.com .. Electronics .. ENG_CD_1775146_A2.pdf; OC_FARNELL: unknown; OC_NEWARK: unknown
Y2 Y3 = SparkFun-Clocks:CRYSTAL: Crystals (Generic) These are passive quartz crystals, which can be used as a clock source for a microcontroller. Crystal's are two-terminal devices. They require external "load" capacitors to generate an oscillating signal.